# Altium schematic sheet Analog Digital Converter.SchDoc: Analog Digital Converter
size A4; DocumentNumber: 54; SheetNumber: 54; SheetTotal: 54
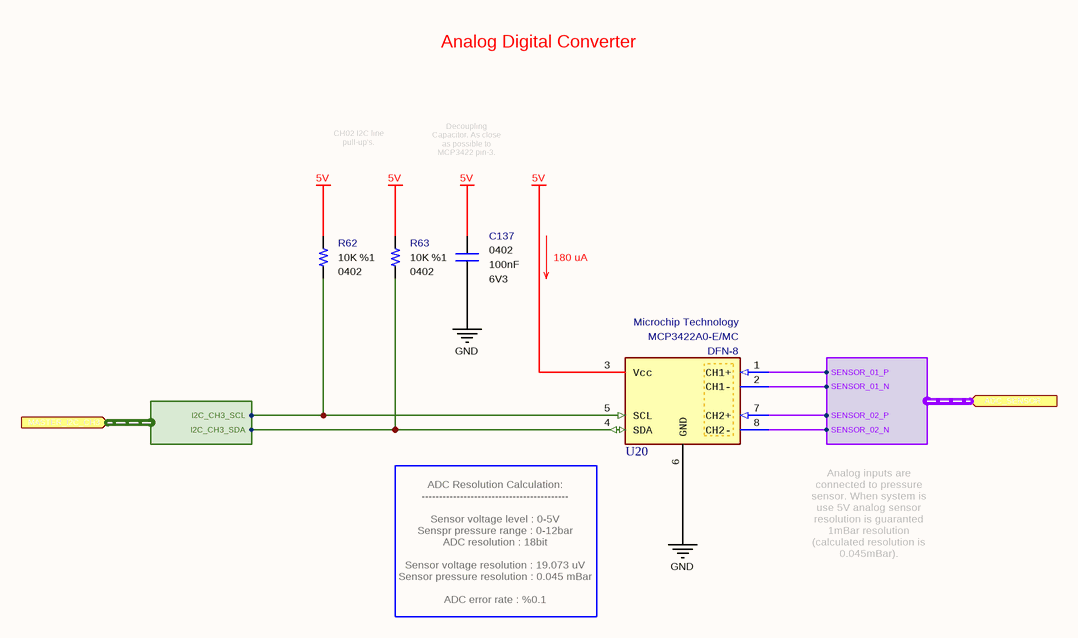
[diagram p0: Analog Digital Converter.SchDoc]

## Parts
C137  value 100nF  Case: 0402  Voltage: 6V3  [CAPACITOR_0402]  (hidden comment: Multilayer Ceramic Capacitor)
R62  value 10K  Tolerance: %1  Case: 0402  [RESISTOR_0402]  (hidden comment: Thick Film Resistor)
R63  value 10K  Tolerance: %1  Case: 0402  [RESISTOR_0402]  (hidden comment: Thick Film Resistor)
U20  Manufacturer Part Number: MCP3422A0-E/MC  Manufacturer Name: Microchip Technology  [DFN-8]  (hidden comment: Analog to Digital Converters - ADC)

## Ports
ADC_SENSOR (in, harness ADC_SENSOR), MASTER_I2C_CH3 (in, harness MASTER_I2C_CH3)

## Harnesses
MASTER_I2C_CH3: I2C_CH3_SDA, I2C_CH3_SCL
ADC_SENSOR: SENSOR_01_P, SENSOR_01_N, SENSOR_02_P, SENSOR_02_N

## Nets
5V: C137.2 R62.2 R63.2 U20.3(Vcc)
GND: C137.1 U20.6(GND)
NetR62_1: R62.1 U20.5(SCL) ; port MASTER_I2C_CH3.I2C_CH3_SCL
NetR63_1: R63.1 U20.4(SDA) ; port MASTER_I2C_CH3.I2C_CH3_SDA
NetU20_1: U20.1(CH1+) ; port ADC_SENSOR.SENSOR_01_P
NetU20_2: U20.2(CH1-) ; port ADC_SENSOR.SENSOR_01_N
NetU20_7: U20.7(CH2+) ; port ADC_SENSOR.SENSOR_02_P
NetU20_8: U20.8(CH2-) ; port ADC_SENSOR.SENSOR_02_N

## Notes on the sheet
- Analog Digital Converter
- CH02 I2C line pull-up's.
- Decoupling Capacitor. As close as possible to MCP3422 pin-3.
- 180 uA
- Analog inputs are connected to pressure sensor. When system is use 5V analog sensor resolution is guaranted 1mBar resolution (calculated resolution is 0.045mBar).
- (near U20) ADC Resolution Calculation:
  ------------------------------------------
  Sensor voltage level : 0-5V
  Senspr pressure range : 0-12bar
  ADC resolution : 18bit
  Sensor voltage resolution : 19.073 uV
  Sensor pressure resolution : 0.045 mBar
  ADC error rate : %0.1
- Title
- Size:
- Date:
- A4
- Number:
- Time:
- Revision:
- Sheet
- of
- File:

## Library data of the parts
C137 = Capacitor - 100nF [0402-6V3]: Capacitor - 100nF [0402-6V3] (Ceramic); Manufacturer Name: AVX; Manufacturer Part Number: 04026D104KAT4A; Dielectric: X5R; Tolerance: %10; Height: 0.25mm; ComponentLink1Description: Mouser; ComponentLink1URL: https://www.mouser.com.tr/ProductDetail/AVX/04026D104KAT4A?qs=sGAEpiMZZMs0AnBnWHyRQPg4iYkCw7IMED%2F4kpqgf7w%3D; ComponentLink2Description: DataSheet; ComponentLink2URL: https://www.mouser.com.tr/datasheet/2/40/cx5r-776519.pdf; ROHS: Yes; Maximum Operating Temperature: +85; Minimum Operating Temperature: -55; Supplier 1: Avnet; Supplier Part Number 1: 04026D104KAT4A; Mouser Part Number: 581-04026D104KAT4A
R62 R63 = Resistor - 10K: Thick Film Resistors - SMD 1/16 W 10 Kohms 1%; Manufacturer Name: Vishay; Manufacturer Part Number: CRCW040210K0FKED; Height: 0.4mm; ComponentLink1Description: DataSheet; ComponentLink1URL: https://www.mouser.com.tr/datasheet/2/427/dcrcwe3-1762152.pdf; ComponentLink2Description: Mouser; ComponentLink2URL: https://www.mouser.com.tr/ProductDetail/Vishay-Dale/CRCW040210K0FKED?qs=sGAEpiMZZMu61qfTUdNhG2DpbjADlD3GcalbOv9utCY%3D; Supplier 1: Mouser; Supplier 2: Digi-Key; Supplier Part Number 1: 71-CRCW040210K0FKEDH; Supplier Part Number 2: 541-10.0KYCT-ND; Mouser Part Number: 71-CRCW0402-10K-E3
U20 = IC - MCP3422: Analog to Digital Converters - ADC 18B delta-sigma ADC dual Ch 4sps; ComponentLink1Description: DataSheet; ComponentLink1URL: http://www.ti.com/general/docs/suppproductinfo.tsp?distId=26&gotoUrl=http%3A%2F%2Fwww.ti.com%2Flit%2Fgpn%2Ftca9517a; ComponentLink2Description: Mouser; ComponentLink2URL: https://www.mouser.com.tr/ProductDetail/Texas-Instruments/TCA9517ADGKR?qs=%252BrH4t%252BeVZ2M4pVnwXR4oNA==; Minimum Operating Temperature: -40; Maximum Operating Temperature: +125; Supplier 1: Avnet; Supplier 2: Mouser; Supplier 3: Arrow; Supplier 4: Digi-Key; Supplier Part Number 1: MCP3422A0-E/MC; Supplier Part Number 2: 579-MCP3422A0-E/MC; Supplier Part Number 3: MCP3422A0-E/MC; Supplier Part Number 4: MCP3422A0-E/MC-ND; Case: DFN-8; Mouser Part Number: 579-MCP3422A0-E/MC